# Altium project MiroCard.PrjPcb (part 2 of 2)

## Sheet 04 - Sensors.SchDoc: Sensors
size A4; DrawnBy: LS, OB, AB, AG, IM; Organization: Miromico; Revision: 3; SheetNumber: 5; SheetTotal: 5; SchemaTitle: Sensors
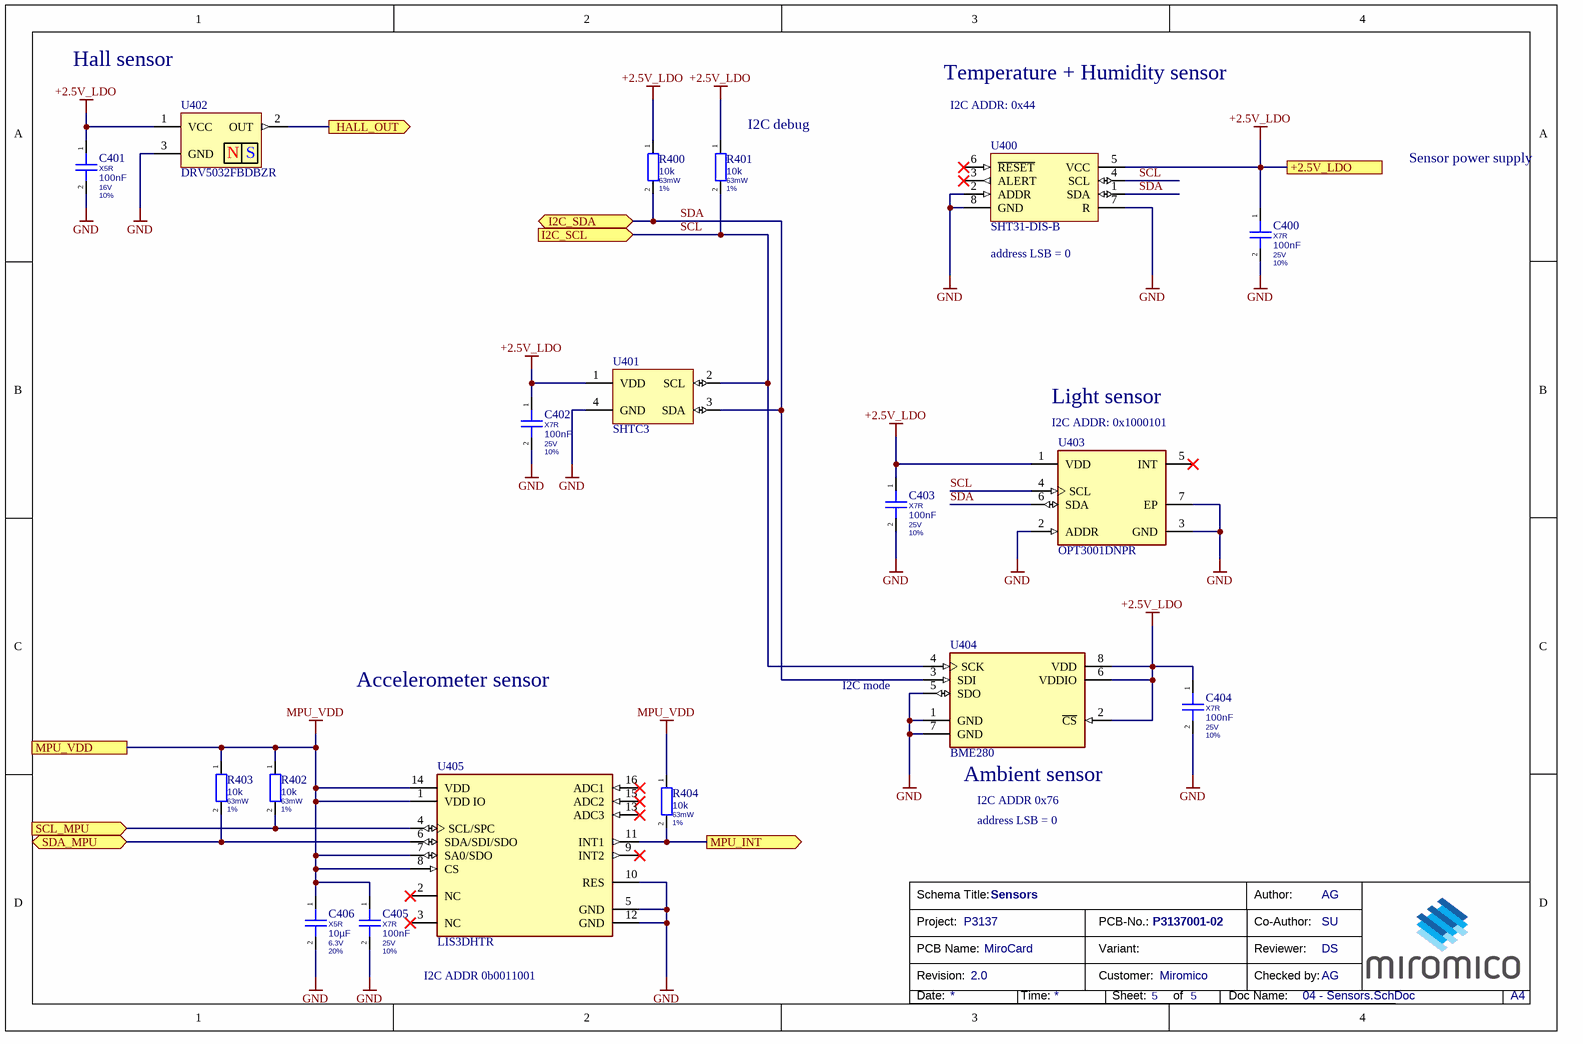
[diagram p4: 04 - Sensors.SchDoc]

### Parts
C400  Dielectric: X7R  Capacitance: 100nF  Voltage Rating: 25V  Tolerance: 10%  [CAPC0402(1005)60_L]  (hidden comment: GRM155R71E104KE14J)
C401  Dielectric: X5R  Capacitance: 100nF  Voltage Rating: 16V  Tolerance: 10%  [CAPC0402(1005)60_L]  (hidden comment: GRM155R61C104KA88D)
C402  Dielectric: X7R  Capacitance: 100nF  Voltage Rating: 25V  Tolerance: 10%  [CAPC0402(1005)60_L]  (hidden comment: GRM155R71E104KE14J)
C403  Dielectric: X7R  Capacitance: 100nF  Voltage Rating: 25V  Tolerance: 10%  [CAPC0402(1005)60_L]  (hidden comment: GRM155R71E104KE14J)
C404  Dielectric: X7R  Capacitance: 100nF  Voltage Rating: 25V  Tolerance: 10%  [CAPC0402(1005)60_L]  (hidden comment: GRM155R71E104KE14J)
C405  Dielectric: X7R  Capacitance: 100nF  Voltage Rating: 25V  Tolerance: 10%  [CAPC0402(1005)60_L]  (hidden comment: GRM155R71E104KE14J)
C406  Dielectric: X5R  Capacitance: 10µF  Voltage Rating: 6.3V  Tolerance: 20%  [CAPC0402(1005)60_L]  (hidden comment: GRJ155R60J106ME11D)
R400  Resistance: 10k  Power Rating: 63mW  Tolerance: 1%  [RESC0201(0603)_L]  (hidden comment: AC0402FR-0710KL)
R401  Resistance: 10k  Power Rating: 63mW  Tolerance: 1%  [RESC0201(0603)_L]  (hidden comment: AC0402FR-0710KL)
R402  Resistance: 10k  Power Rating: 63mW  Tolerance: 1%  [RESC0201(0603)_L]  (hidden comment: AC0402FR-0710KL)
R403  Resistance: 10k  Power Rating: 63mW  Tolerance: 1%  [RESC0201(0603)_L]  (hidden comment: AC0402FR-0710KL)
R404  Resistance: 10k  Power Rating: 63mW  Tolerance: 1%  [RESC0201(0603)_L]  (hidden comment: AC0402FR-0710KL)
U400  SHT31-DIS-B  [8  -  Pin DFN 2.5  x  2.5  mm x 0.9 mm]
U401  SHTC3  [SHTC1-Footprint-1]
U402  DRV5032FBDBZR  [SOT23-3]
U403  OPT3001DNPR  [FP-DNP0006A-MFG]
U404  BME280  [FP-BME280-MFG]
U405  LIS3DHTR  [FP-LGA-16-7983231-MFG]

### Ports
+2.5V_LDO, HALL_OUT (out), I2C_SCL (in), I2C_SDA (bidir), MPU_INT (out), MPU_VDD, SCL_MPU (in), SDA_MPU (bidir)

### Nets
+2.5V_LDO: C400.1 C401.1 C402.1 C403.1 C404.1 R400.1 R401.1 U400.5(VCC) U401.1(VDD) U402.1(VCC) U403.1(VDD) U404.2(~{CS}) U404.6(VDDIO) U404.8(VDD) ; port +2.5V_LDO
GND: C400.2 C401.2 C402.2 C403.2 C404.2 C405.2 C406.2 U400.2(ADDR) U400.7(R) U400.8(GND) U401.4(GND) U402.3(GND) U403.2(ADDR) U403.3(GND) U403.7(EP) U404.1(GND) U404.5(SDO) U404.7(GND) U405.5(GND) U405.10(RES) U405.12(GND)
MPU_VDD: C405.1 C406.1 R402.1 R403.1 R404.1 U405.1(VDD_IO) U405.7(SA0/SDO) U405.8(CS) U405.14(VDD) ; port MPU_VDD
SCL: R401.2 U400.4(SCL) U401.2(SCL) U403.4(SCL) U404.4(SCK) ; port I2C_SCL
SDA: R400.2 U400.1(SDA) U401.3(SDA) U403.6(SDA) U404.3(SDI) ; port I2C_SDA
NetR402_2: R402.2 U405.4(SCL/SPC) ; port SCL_MPU
NetR403_2: R403.2 U405.6(SDA/SDI/SDO) ; port SDA_MPU
NetR404_2: R404.2 U405.11(INT1) ; port MPU_INT
NetU100_31: U402.2(OUT) ; port HALL_OUT

Not connected (* = marked no-connect by the designer): U400 3(ALERT)* 6(~{RESET})*; U403 5(INT)*; U405 2(NC)* 3(NC)* 9(INT2)* 13(ADC3)* 15(ADC2)* 16(ADC1)*

### Notes on the sheet
- Hall sensor
- Temperature + Humidity sensor
- I2C ADDR: 0x44
- (near R401) I2C debug
- Sensor power supply
- (near U400) address LSB = 0
- Light sensor
- (near U403) I2C ADDR: 0x1000101
- Accelerometer sensor
- I2C mode
- (near U404) Ambient sensor
- address LSB = 0
- I2C ADDR 0x76
- I2C ADDR 0b0011001
- Schema Title:
- Project:
- PCB-No.:
- Author:
- Co-Author:
- Revision:
- PCB Name:
- Customer:
- Variant:
- Reviewer:
- Checked by:
- Date:
- Time:
- Sheet:
- of
- Doc Name:
- A4
- (in symbol CMP-00218-05) N; S

### Library data of the parts
C400 C402-C405 = CMP-00416-02: 0.1µF ±10% 25V Ceramic Capacitor X7R 0402 (1005 Metric); Manufacturer: Murata Electronics; ComponentLink1Description: Datasheet; Manufacturer Part Number: GRM155R71E104KE14J; Supplier 1: Digi-Key; Supplier Part Number 1: 490-14603-1-ND; Mount: Surface Mount; Case/Package: 0402; Case Code (Imperial): 0402; Case Code (Metric): 1005; Weight: 0.000212oz; Min Operating Temperature: -55°C; Max Operating Temperature: 125°C; Packaging: Tape and Reel; Termination: SMD/SMT; Resistor Type: Ceramic; Voltage Rating (DC): 25V; Package Quantity: 50000; Length: 0.039inch; Width: 0.5mm; Height: 0.5mm; Thickness: 0.022inch
C401 = CMP-00416-01: 0.1µF ±10% 16V Ceramic Capacitor X5R 0402 (1005 Metric); Manufacturer: Murata Electronics; ComponentLink1Description: Datasheet; Manufacturer Part Number: GRM155R61C104KA88D; Supplier 1: Digi-Key; Supplier Part Number 1: 490-5415-1-ND; Mount: Surface Mount; Case/Package: 0402; Case Code (Metric): 1005; Case Code (Imperial): 0402; Min Operating Temperature: -55°C; Max Operating Temperature: 85°C; Package Quantity: 1; Packaging: Tape and Reel; Termination: SMD/SMT; Voltage: 16V; Voltage Rating (DC): 16V; Length: 1mm; Width: 0.02inch; Height: 0.5mm; Thickness: 0.022inch; Depth: 0.5mm; Radiation Hardening: No; REACH SVHC: No SVHC; Lead Free: Lead Free
C406 = CMP-00462-01: 10µF ±20% 6.3V Ceramic Capacitor X5R 0402 (1005 Metric); Manufacturer: Murata Electronics; ComponentLink1Description: Datasheet; Manufacturer Part Number: GRJ155R60J106ME11D; Supplier 1: Digi-Key; Supplier Part Number 1: 490-13211-1-ND; Mount: Surface Mount; Case/Package: 0402; Case Code (Metric): 1005; Case Code (Imperial): 0402; Min Operating Temperature: -55°C; Max Operating Temperature: 85°C; Packaging: Cut Tape; Features: Soft Termination; Length: 0.039inch; Width: 0.02inch; Thickness: 0.028inch
R400-R404 = CMP-00411-03: 10 kOhms ±1% 0.063W, 1/16W Chip Resistor 0402 (1005 Metric) Automotive AEC-Q200, Moisture Resistant Thick Film; Manufacturer: Yageo; ComponentLink1Description: Datasheet; ComponentLink1URL: https://www.yageo.com/upload/media/product/productsearch/datasheet/rchip/PYu-AC_51_RoHS_L_7.pdf; Manufacturer Part Number: AC0402FR-0710KL; Supplier 1: Digi-Key; Supplier Part Number 1: YAG3436CT-ND
U400 = CMP-00089-03: SENSIRION         SHT31-DIS-B             Humidity Sensor, 2 %, 3.3 V, 0% to 100% Relative Humidity, TDFN, 8 Pins, 8 s; Response Time: 8s; Operating Supply Voltage: 3.3V; Interface: I2C; Min Supply Voltage: 2.4V; Max Supply Voltage: 5.5V; Accuracy: 2%; Sensor Type: Temperature; Output Type: I2C, Digital; Mount: Surface Mount; Case/Package: DFN; Number of Pins: 8; Min Operating Temperature: -40°C; Max Operating Temperature: 125°C; Packaging: Cut Tape; Length: 2.6mm; Height: 1mm; Width: 2.6mm; REACH SVHC: No SVHC; Lead Free: Lead Free; Datasheet: https://www.sensirion.com/fileadmin/user_upload/customers/sensirion/Dokumente/0_Datasheets/Humidity/Sensirion_Humidity_Sensors_SHT3x_Datasheet_digital.pdf; Manufacturer: Sensirion; Manufacturer Part Number: SHT31-DIS-B; Supplier 1: Digi-Key; Supplier Part Number 1: 1649-1011-1-ND; ComponentLink1Description: Datasheet
U401 = CMP-00193-05: SENSOR HUMI/TEMP I2C 2% SMD; Manufacturer: Sensirion; ComponentLink1Description: Datasheet; ComponentLink1URL: https://media.digikey.com/pdf/Data%20Sheets/Sensirion%20PDFs/HT_DS_SHTC3_D1.pdf; Datasheet: https://media.digikey.com/pdf/Data%20Sheets/Sensirion%20PDFs/HT_DS_SHTC3_D1.pdf; Manufacturer Part Number: SHTC3; Supplier 1: Digikey; Supplier Part Number 1: 1649-1100-1-ND
U402 = CMP-00218-05: HAL SENSOR, ULTRA-LOW POWER, 1.65V TO 5.5V; Manufacturer: Texas Instruments; ComponentLink1Description: Datasheet; ComponentLink1URL: http://www.ti.com/general/docs/suppproductinfo.tsp?distId=10&gotoUrl=http%3A%2F%2Fwww.ti.com%2Flit%2Fgpn%2Fdrv5032; Manufacturer Part Number: DRV5032FBDBZR; Supplier 1: Digikey; Supplier Part Number 1: 296-47323-1-ND; Min Operating Temperature: -40°C; Max Operating Temperature: 85°C
U403 = CMP-04942-000002-1: SENSOR OPT 550NM AMBIENT 6USON; Manufacturer: Texas Instruments; Max Junction Temp: +150°C; Operating Supply Current: 0.3-1.8uA; Sensor Output: I2C,SMBus; Max Supply Voltage: 3.6V; Min Supply Voltage: 1.6V; Standoff Height: 0mm; Package: DNP0006A; Device Class L2: Optical Sensors; Temperature Range Low: -40°C; Digikey Description: SENSOR OPT 550NM AMBIENT 6USON; Automotive: No; Category: IC; Manufacturer Part Number: OPT3001DNPR; RoHS: TRUE; ComponentLink2URL: http://www.ti.com/lit/ds/symlink/opt3001.pdf; Lead Free: Yes; Octopart: https://octopart.com/opt3001dnpr-texas+instruments-47324050; Device Class L3: unset; ComponentLink2Description: Datasheet; Device Class L1: Sensors; Temperature Range High: +85°C; Temperature: -40°C to +85°C; Height: 0.65mm; Ipc Land Pattern Name: DFN200X200X60-6
U404 = CMP-191074-000001-1: SENSOR PRESSURE HUMIDITY TEMP; Output Type: SPI; Sensor Type: Temperature; Response Time: 1s; Accuracy: 3%; Packaging: Cut Tape; Lead Free: Lead Free; Number of Pins: 8; Min Operating Temperature: -40°C; Max Operating Temperature: 85°C; Mount: Surface Mount; Case/Package: LGA
U405 = CMP-12175-000011-1: ACCEL 2-16G I2C/SPI 16LGA; Interface: I2C; Bandwidth: 5kHz; Operating Supply Voltage: 2.5V; Min Supply Voltage: 1.71V; Resolution: 16b; Max Supply Voltage (DC): 3.6V; Axis: X, Y, Z; Operating Supply Current: 11uA; Sensor Type: 3 Axis; Output Type: Digital; Lead Free: Lead Free; Case/Package: LGA; REACH SVHC: No SVHC; Width: 3mm; Height: 1mm; Packaging: Tape and Reel; Contact Plating: Gold; Length: 3mm; Package Quantity: 1; Min Supply Voltage (DC): 1.71V; Max Operating Temperature: 85°C; Min Operating Temperature: -40°C; Number of Pins: 16; Radiation Hardening: No; Depth: 3mm; Max Supply Voltage: 3.6V

## Nets that join several sheets
+2.5V_LDO: 01 - CC2650 (FB100.1 J100.1 J101.1), 02 - EnergyManagementUnit (5 pins), 03 - AEM10941 (J300.3 R301.1), 04 - Sensors (14 pins)
GND: 00 - Overview (U1.2), 01 - CC2650 (29 pins), 02 - EnergyManagementUnit (23 pins), 03 - AEM10941 (20 pins), 04 - Sensors (21 pins)
MPU_VDD: 01 - CC2650 (U100.18), 04 - Sensors (9 pins)
V_CAP: 01 - CC2650 (R106.2), 02 - EnergyManagementUnit (12 pins), 03 - AEM10941 (J300.4 U300.16)
VSRC: 00 - Overview (U1.1), 03 - AEM10941 (J300.1 U300.25 U300.26)
COMP0: 01 - CC2650 (U100.38), 02 - EnergyManagementUnit (J200.1 U200.1)
COMP1: 01 - CC2650 (U100.40), 02 - EnergyManagementUnit (J200.2 R201.2 U202.1)
NetR402_2: 01 - CC2650 (U100.15), 04 - Sensors (R402.2 U405.4)
NetR403_2: 01 - CC2650 (U100.14), 04 - Sensors (R403.2 U405.6)
NetR404_2: 01 - CC2650 (U100.36), 04 - Sensors (R404.2 U405.11)
NetU100_31: 01 - CC2650 (U100.31), 04 - Sensors (U402.2)
NetU100_37: 01 - CC2650 (U100.37), 02 - EnergyManagementUnit (U200.11)
NetU200_7: 02 - EnergyManagementUnit (U200.7), 03 - AEM10941 (U300.20)
SCL: 01 - CC2650 (J102.3 U100.5), 04 - Sensors (5 pins)
SDA: 01 - CC2650 (J102.4 U100.6), 04 - Sensors (5 pins)

## Assembly variants
default: not fitted C200 C201 C202 C203 C402 C402 C403 C403 C404 C404 C405 C406 C407 J100 J102 J200 J300 R100 R101 R101 R203 R300 R302 R305 R306 R308 R310 R313 R314 R315 R316 R317 R319 R402 R403 R404 U401 U401 U403 U403 U404 U404 U405